# Altium project uz_frontpanel.PrjPcb
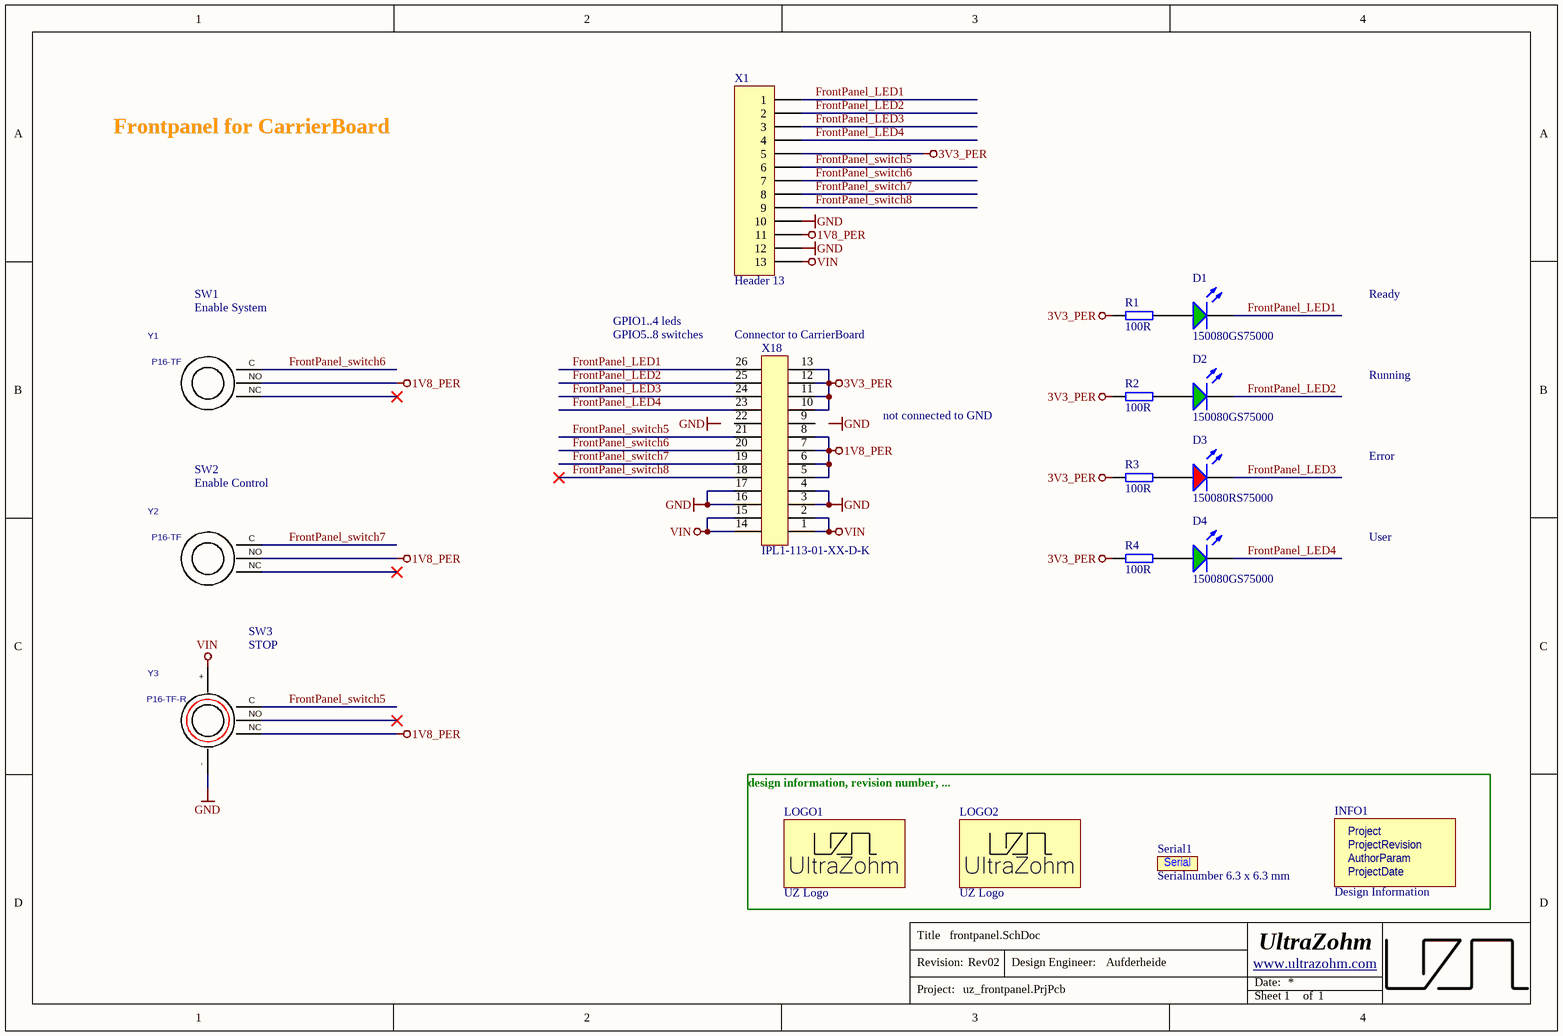
[diagram p0: frontpanel.SchDoc]
ProjectRevision: Rev02; ProjectDate: 11/2022; Project: UZ_Frontpanel; AuthorParam: Aufderheide
1 sheet, 17 parts. Net scope: global (net labels, ports and power ports of the same name join across sheets).
Board file: frontpanel.PcbDoc

## Sheet frontpanel.SchDoc
size A4; Organization: UltraZohm; SheetNumber: 1; SheetTotal: 1; Website: www.ultrazohm.com

### Parts
D1  150080GS75000  [LEDM2012X80N]
D2  150080GS75000  [LEDM2012X80N]
D3  150080RS75000  [LEDM2012X80N]
D4  150080GS75000  [LEDM2012X80N]
INFO1  Design Information  [Design_info]  (no BOM)
LOGO1  UZ Logo  [UZ_Logo_small]  (no BOM)
LOGO2  UZ Logo  [UZ_Logo_small]  (no BOM)
R1  100R  [RES 0805_2012]
R2  100R  [RES 0805_2012]
R3  100R  [RES 0805_2012]
R4  100R  [RES 0805_2012]
Serial1  Serialnumber 6.3 x 6.3 mm  [SERIAL_6.3X6.3MM]  (no BOM)
X1  Header 13  [HDR1X13]
X18  IPL1-113-01-XX-D-K  [IPL1-113-01-XX-D-K]
Y1  P16-TF  [P16-TF]
Y2  P16-TF  [P16-TF]
Y3  P16-TF-R  [P16-TF-R]

### Nets
1V8_PER: X1.11 X18.5 X18.6 X18.7 X18.8 Y1.NO Y2.NO Y3.NC
3V3_PER: R1.1 R2.1 R3.1 R4.1 X1.5 X18.10 X18.11 X18.12 X18.13
GND: X1.10 X1.12 X18.3 X18.4 X18.16 X18.17 Y3.-
VIN: X1.13 X18.1 X18.2 X18.14 X18.15 Y3.+
FrontPanel_LED1: D1.1(K) X1.1 X18.26
FrontPanel_LED2: D2.1(K) X1.2 X18.25
FrontPanel_LED3: D3.1(K) X1.3 X18.24
FrontPanel_LED4: D4.1(K) X1.4 X18.23
FrontPanel_switch5: X1.6 X18.21 Y3.C
FrontPanel_switch6: X1.7 X18.20 Y1.C
FrontPanel_switch7: X1.8 X18.19 Y2.C
FrontPanel_switch8: X1.9 X18.18
NetD1_2: D1.2(A) R1.2
NetD2_2: D2.2(A) R2.2
NetD3_2: D3.2(A) R3.2
NetD4_2: D4.2(A) R4.2

Not connected (* = marked no-connect by the designer): X18 9 22; Y1 NC*; Y2 NC*; Y3 NO*

### Notes on the sheet
- Frontpanel for CarrierBoard
- SW1
- Enable System
- Ready
- (near X18) GPIO5..8 switches
- GPIO1..4 leds
- (near X18) Connector to CarrierBoard
- Running
- not connected to GND
- SW2
- Enable Control
- Error
- User
- SW3
- (near Y3) STOP
- design information, revision number, ...
- Labels drawn without touching a wire or pin: GND
- Title
- Revision:
- Design Engineer:
- Date:
- Project:
- Sheet
- of
- (in symbol Design Information) Project; ProjectRevision; AuthorParam; ProjectDate
- (in symbol Serial Number) Serial

### Library data of the parts
D1 D2 D4 = 150080GS75000: WL-SMCW SMD Mono-color Chip LED Waterclear Green 0805; Manufacturer: Wuerth Elektronik; Type: Standard; Created from: MGremer; Forward Current I_f: 20 mA; Forward Voltage U_f: 3.2 V; Wavelength: 520 nm; Light Intensity: 450 mcd; Nominal Power: 105 mW; Manufacturer Part Number: 150080GS75000; PartID: 11; Created On: 08.12.2020 10:52:57; ComponentLink1Description: Datasheet; ComponentLink1URL: https://www.mouser.de/datasheet/2/445/150080GS75000-1715657.pdf; Component Type: LED Diode; Device Package: 0805; Last Updated: 02.11.2021 13:03:08; Mounting Type: SMD; Operating Temperature: -40 - 85 °C; Supplier 1: Mouser; Supplier Part Number 1: 710-150080GS75000; Live Cycle Status: 1; Stock number: not stored; Color: green; LCSC Part #: C2297
D3 = 150080RS75000: WL-SMCW SMD Mono-color Chip LED Waterclear Red 0805; Manufacturer: Wuerth Elektronik; Type: Standard; Created from: MGremer; Forward Current I_f: 20 mA; Forward Voltage U_f: 2 V; Wavelength: 625 nm; Light Intensity: 150 mcd; Nominal Power: 72 mW; Manufacturer Part Number: 150080RS75000; PartID: 12; Created On: 08.12.2020 10:52:57; ComponentLink1Description: Datasheet; ComponentLink1URL: https://www.mouser.de/datasheet/2/445/150080RS75000-1714740.pdf; Component Type: LED Diode; Device Package: 0805; Last Updated: 03.03.2021 09:59:52; Mounting Type: SMD; Operating Temperature: -40 - 85 °C; Supplier 1: Mouser; Supplier Part Number 1: 710-150080RS75000; Live Cycle Status: 1; Stock number: not stored; Color: red; LCSC Part #: C84256
INFO1 = Design Information: Manufacturer: UltraZohm; Created from: MGremer; Manufacturer Part Number: Design Information; PartID: 12; Created On: 03.11.2021 09:04:23; ComponentLink1Description: https://docs.ultrazohm.com/; ComponentLink1URL: homepage; Component Type: Design Information; Last Updated: 03.11.2021 09:28:34; Supplier 1: -; Supplier Part Number 1: -; Type: Design Information; Value: Design Information; Live Cycle Status: 1
LOGO1 LOGO2 = Logo small: Manufacturer: UltraZohm; Created from: MGremer; Created: Jan2021_Liegmann; Value: Logo; Manufacturer Part Number: Logo small; PartID: 10; Created On: 03.11.2021 09:04:23; ComponentLink1Description: https://docs.ultrazohm.com/; ComponentLink1URL: homepage; Component Type: Logo; Last Updated: 03.11.2021 09:05:50; Supplier 1: -; Supplier Part Number 1: -; Type: Logo; Live Cycle Status: 1
R1-R4 = CR0805-FX-2200ELF: SMD resistor 1%; Manufacturer Part Number: CR0805FX-1000ELF; Manufacturer: Bourns; Created from: MGremer; PartID: 199; Created On: 14.12.2020 16:17:14; ComponentLink1Description: Datasheet; ComponentLink1URL: https://www.mouser.de/datasheet/2/54/crxxxxx-1858361.pdf; Component Type: SMD resistor; Device Package: 0805; Last Updated: 14.12.2020 18:22:52; Mounting Type: SMD; Supplier 1: Mouser; Supplier Part Number 1: 652-CR0805FX-1000ELF; Type: Resistor; Tolerance: 1%; Value: 100R; Live Cycle Status: 1; Stock number: not stored; LCSC Part #: C17408
Serial1 = Serial Number: Manufacturer: UltraZohm; Value: REV; Created from: MGremer; Created: 2018_09_18_AGeiger; Manufacturer Part Number: Serial Number; PartID: 11; Created On: 03.11.2021 09:04:23; ComponentLink1Description: https://docs.ultrazohm.com/; ComponentLink1URL: homepage; Component Type: Serial Number; Last Updated: 03.11.2021 09:28:34; Supplier 1: -; Supplier Part Number 1: -; Type: Serial Number; Live Cycle Status: 1
X1 = Header 13: Header, 13-Pin; LatestRevisionDate: 17-Jul-2002; LatestRevisionNote: Re-released for DXP Platform.; Publisher: Altium Limited
X18 = IPL1-113-01-XX-D-K: 2.54 mm Double Row Termin Assembly (THT); Manufacturer: SAMTEC; AN: 30828; Mixed: SMT; H-ART: IPL1-113-02-L-D-K; Temperature-Range: -55/+125; Extra: Connector Header IPL1, 2-row 26pos, key polarization, SMT 0°; Created from: MGremer; Number of positions: 13; Case: IPL1; HelpURL: b:\AD\adlib\datasheet\Samtec\IPL1-SMT\; Manufacturer Part Number: IPL1-113-01-XX-D-K; PartID: 52; Created On: 30.11.2020 10:38:50; ComponentLink1Description: Homepage; ComponentLink1URL: https://www.samtec.com/products/ipl1; Component Type: Samtec Connector; Device Package: Connector; Last Updated: 04.11.2021 06:39:07; Mounting Type: THT; Supplier 1: SAMTEC; Supplier Part Number 1: IPL1-113-01-L-D-K; Type: Connector; Live Cycle Status: 1; Number of rows: 2; Stock number: not stored
Y1 Y2 = P16-TF: Stainless steel push botton 0.63 inch flat; Manufacturer: Metzler; Created from: MGremer; Manufacturer Part Number: P16-TF; PartID: 8; Created On: 02.03.2021 14:59:37; ComponentLink1Description: Datasheet; ComponentLink1URL: https://www.led-taster.de/mediafiles/Sonstiges/Datenblatt_LED_Drucktaster_6-24V.pdf; ComponentLink2Description: Homepage; ComponentLink2URL: https://www.led-taster.de/Edelstahl-Drucktaster-O16mm-Flach; Component Type: push button; Device Package: THT; Last Updated: 18.08.2021 09:35:14; Minimum Order: 1; Mounting Type: THT; Supplier 1: Metzler; Supplier Part Number 1: P16-TF; Type: push button; Live Cycle Status: 1; Stock number: not stored
Y3 = P16-TF-R: Stainless steel push botton 0.63 inch flat LED Ring red; Manufacturer: Metzler; Created from: MGremer; Manufacturer Part Number: P16-TF-R; PartID: 7; Created On: 02.03.2021 14:59:37; ComponentLink1Description: Datasheet; ComponentLink1URL: https://www.led-taster.de/mediafiles/Sonstiges/Datenblatt_LED_Drucktaster_6-24V.pdf; ComponentLink2Description: Homepage; ComponentLink2URL: https://www.led-taster.de/O16mm-flacher-Edelstahl-Taster-mit-roter-LED-Ringbeleuchtung; Component Type: LED push button; Device Package: THT; Last Updated: 18.08.2021 09:33:57; Minimum Order: 1; Mounting Type: THT; Supplier 1: Metzler; Supplier Part Number 1: P16-TF-R; Type: LED push button red; Live Cycle Status: 1; Stock number: not stored